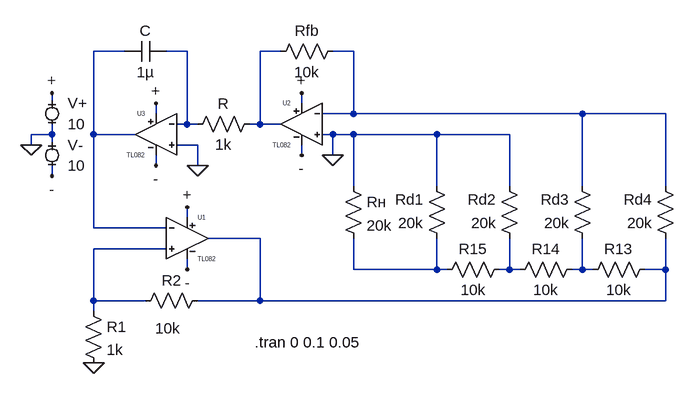
[diagram p0: schematic shema.asc]
shema.asc, the LTspice schematic file:
Version 4
SHEET 1 1764 932
WIRE -528 144 -576 144
WIRE -432 144 -464 144
WIRE -288 144 -320 144
WIRE -176 144 -208 144
WIRE -640 224 -640 208
WIRE -256 224 -256 208
WIRE -480 240 -480 224
WIRE -176 240 -176 144
WIRE -176 240 -224 240
WIRE 176 240 -176 240
WIRE 304 240 176 240
WIRE -432 256 -432 144
WIRE -432 256 -448 256
WIRE -416 256 -432 256
WIRE -320 256 -320 144
WIRE -320 256 -336 256
WIRE -288 256 -320 256
WIRE -640 272 -640 256
WIRE -640 272 -672 272
WIRE -576 272 -576 144
WIRE -512 272 -576 272
WIRE -208 272 -224 272
WIRE -176 272 -208 272
WIRE -48 272 -176 272
WIRE 64 272 -48 272
WIRE -672 288 -672 272
WIRE -640 288 -640 272
WIRE -416 288 -448 288
WIRE -256 304 -256 288
WIRE -208 304 -208 272
WIRE -480 320 -480 304
WIRE -416 320 -416 288
WIRE -640 336 -640 320
WIRE -176 352 -176 272
WIRE -48 352 -48 272
WIRE 64 352 64 272
WIRE 176 352 176 240
WIRE 304 352 304 240
WIRE -432 400 -432 384
WIRE -576 416 -576 272
WIRE -464 416 -576 416
WIRE -320 432 -400 432
WIRE -464 448 -576 448
WIRE -432 480 -432 464
WIRE -176 480 -176 432
WIRE -48 480 -48 432
WIRE -48 480 -176 480
WIRE -32 480 -48 480
WIRE 64 480 64 432
WIRE 64 480 48 480
WIRE 80 480 64 480
WIRE 176 480 176 432
WIRE 176 480 160 480
WIRE 192 480 176 480
WIRE 304 480 304 432
WIRE 304 480 272 480
WIRE -576 528 -576 448
WIRE -496 528 -576 528
WIRE -320 528 -320 432
WIRE -320 528 -416 528
WIRE 304 528 304 480
WIRE 304 528 -320 528
WIRE -576 544 -576 528
FLAG -416 320 0
FLAG -576 624 0
FLAG -672 288 0
FLAG -640 208 +
FLAG -640 336 -
FLAG -480 224 +
FLAG -256 208 +
FLAG -432 384 +
FLAG -432 480 -
FLAG -256 304 -
FLAG -480 320 -
FLAG -208 304 0
SYMBOL res 320 448 R180
WINDOW 0 36 76 Left 2
WINDOW 3 36 40 Left 2
SYMATTR InstName Rd4
SYMATTR Value 20k
SYMBOL res 192 448 R180
WINDOW 0 36 76 Left 2
WINDOW 3 36 40 Left 2
SYMATTR InstName Rd3
SYMATTR Value 20k
SYMBOL res 80 448 R180
WINDOW 0 36 76 Left 2
WINDOW 3 36 40 Left 2
SYMATTR InstName Rd2
SYMATTR Value 20k
SYMBOL res -32 448 R180
WINDOW 0 36 76 Left 2
WINDOW 3 36 40 Left 2
SYMATTR InstName Rd1
SYMATTR Value 20k
SYMBOL res 176 496 R270
WINDOW 0 32 56 VTop 2
WINDOW 3 0 56 VBottom 2
SYMATTR InstName R13
SYMATTR Value 10k
SYMBOL res 64 496 R270
WINDOW 0 32 56 VTop 2
WINDOW 3 0 56 VBottom 2
SYMATTR InstName R14
SYMATTR Value 10k
SYMBOL res -48 496 R270
WINDOW 0 32 56 VTop 2
WINDOW 3 0 56 VBottom 2
SYMATTR InstName R15
SYMATTR Value 10k
SYMBOL res -320 240 R90
WINDOW 0 0 56 VBottom 2
WINDOW 3 32 56 VTop 2
SYMATTR InstName R
SYMATTR Value 1k
SYMBOL cap -464 128 R90
WINDOW 0 0 32 VBottom 2
WINDOW 3 32 32 VTop 2
SYMATTR InstName C
SYMATTR Value 1µ
SYMBOL res -400 512 R90
WINDOW 0 0 56 VBottom 2
WINDOW 3 43 62 VTop 2
SYMATTR InstName R2
SYMATTR Value 10k
SYMBOL res -592 528 R0
SYMATTR InstName R1
SYMATTR Value 1k
SYMBOL res -192 336 R0
SYMATTR InstName Rн
SYMATTR Value 20k
SYMBOL res -192 128 R90
WINDOW 0 0 56 VBottom 2
WINDOW 3 32 56 VTop 2
SYMATTR InstName Rfb
SYMATTR Value 10k
SYMBOL MiniSyms4\\voltage- -640 240 R0
SYMATTR InstName V+
SYMATTR Value 10
SYMBOL MiniSyms4\\voltage- -640 304 R0
SYMATTR InstName V-
SYMATTR Value 10
SYMBOL TL082 -432 368 R0
SYMATTR InstName U1
SYMBOL TL082 -256 192 M0
SYMATTR InstName U2
SYMBOL TL082 -480 208 M0
SYMATTR InstName U3
TEXT -328 592 Left 2 !.tran 0 0.1 0.05

The netlist it stands for:
* shema.asc
Rd4 N005 N004 20k
Rd3 N009 N004 20k
Rd2 N008 0 20k
Rd1 N007 0 20k
R13 N009 N005 10k
R14 N008 N009 10k
R15 N007 N008 10k
R N003 N002 1k
C N002 N001 1µ
R2 N005 N006 10k
R1 N006 0 1k
Rн 0 N007 20k
Rfb N004 N003 10k
V+ + 0 10
V- 0 - 10
XU1 N006 N001 + - N005 TL082  ; pins In+ In- V+ V- OUT
XU2 0 N004 + - N003 TL082  ; pins In+ In- V+ V- OUT
XU3 0 N002 + - N001 TL082  ; pins In+ In- V+ V- OUT
.tran 0 0.1 0.05
.lib MyOpamps.lib
.backanno
.end